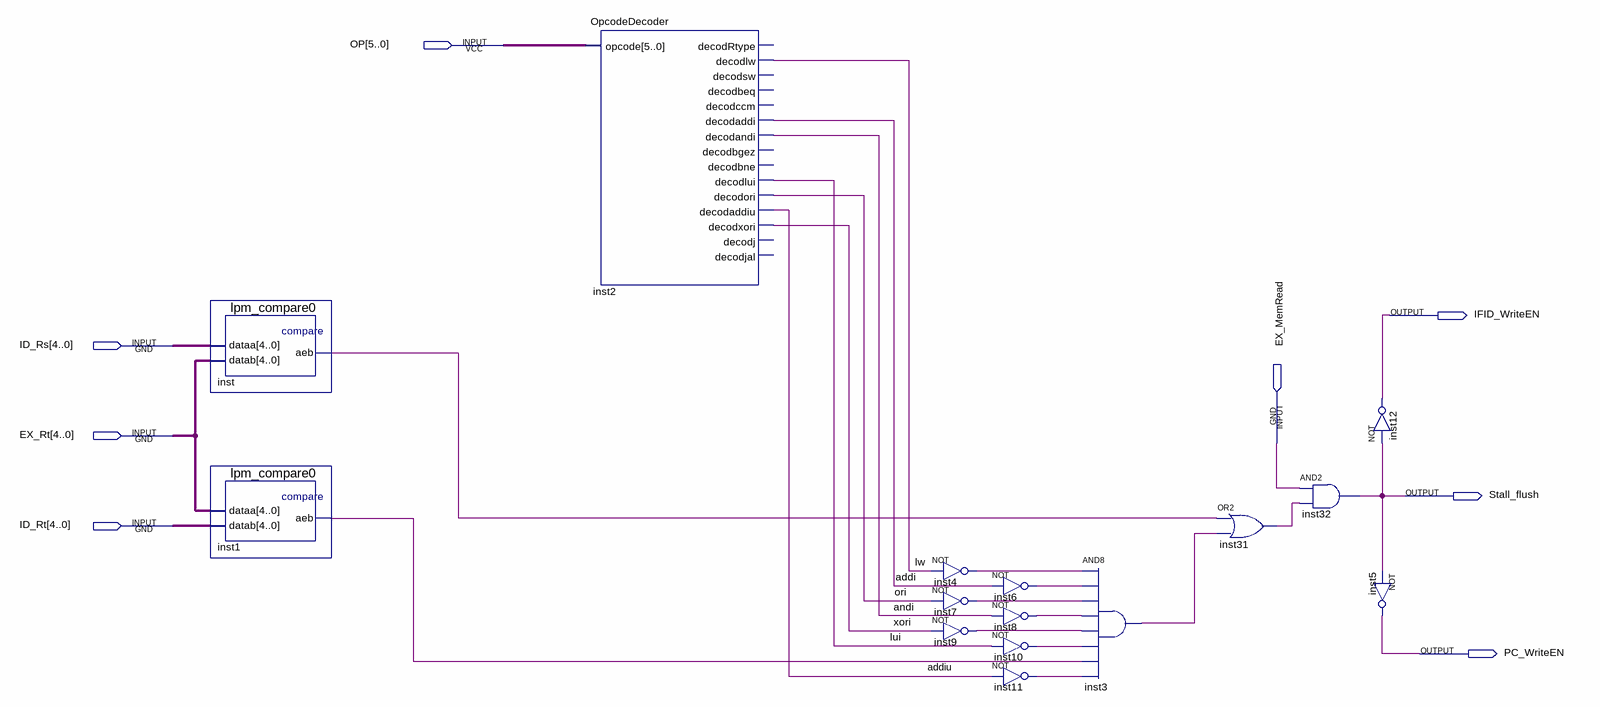
[diagram p0: schematic sheet]
// Quartus schematic Stall.bdf as structural Verilog: 15 symbols, 8 pins
module Stall (
  input  [5:0] OP,
  input  [4:0] ID_Rs,
  input  [4:0] EX_Rt,
  input  EX_MemRead,
  input  [4:0] ID_Rt,
  output IFID_WriteEN,
  output Stall_flush,
  output PC_WriteEN
);

  wire addi, addiu, andi, inst1_aeb, inst3_out, inst4_out, inst6_out, inst7_out, inst8_out, inst9_out,
       inst10_out, inst11_out, inst31_out, inst_aeb, lui, lw, ori, xori;

  lpm_compare0 inst (.dataa(ID_Rs), .datab(EX_Rt), .aeb(inst_aeb));
  lpm_compare0 inst1 (.dataa(EX_Rt), .datab(ID_Rt), .aeb(inst1_aeb));
  OpcodeDecoder inst2 (
    .opcode(OP), .decodlw(lw), .decodaddi(addi), .decodandi(andi), .decodlui(lui), .decodori(ori),
    .decodaddiu(addiu), .decodxori(xori));  // open: decodRtype, decodsw, decodbeq, decodccm, decodbgez, decodbne, decodj, decodjal
  not inst4 (inst4_out, lw);
  not inst7 (inst7_out, ori);
  not inst9 (inst9_out, xori);
  not inst6 (inst6_out, addi);
  not inst8 (inst8_out, andi);
  not inst10 (inst10_out, lui);
  not inst11 (inst11_out, addiu);
  and inst3 (inst3_out, inst4_out, inst6_out, inst7_out, inst8_out, inst9_out, inst10_out, inst1_aeb, inst11_out);
  or inst31 (inst31_out, inst_aeb, inst3_out);
  and inst32 (Stall_flush, EX_MemRead, inst31_out);
  not inst12 (IFID_WriteEN, Stall_flush);
  not inst5 (PC_WriteEN, Stall_flush);
endmodule
